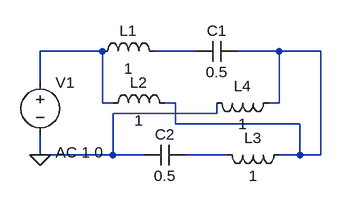
[diagram p0: schematic ej2.asc]
ej2.asc, the LTspice schematic file:
Version 4
SHEET 1 880 680
WIRE 96 64 0 64
WIRE 240 64 176 64
WIRE 368 64 304 64
WIRE 432 64 368 64
WIRE 0 112 0 64
WIRE 96 144 96 64
WIRE 112 144 96 144
WIRE 208 144 192 144
WIRE 368 144 368 64
WIRE 368 144 352 144
WIRE 272 160 272 144
WIRE 272 160 112 160
WIRE 208 176 208 144
WIRE 400 176 208 176
WIRE 0 224 0 192
WIRE 112 224 112 160
WIRE 112 224 0 224
WIRE 160 224 112 224
WIRE 288 224 224 224
WIRE 400 224 400 176
WIRE 400 224 368 224
WIRE 432 224 432 64
WIRE 432 224 400 224
FLAG 0 224 0
SYMBOL ind 80 80 R270
WINDOW 0 32 56 VTop 2
WINDOW 3 5 56 VBottom 2
SYMATTR InstName L1
SYMATTR Value 1
SYMBOL ind 96 160 R270
WINDOW 0 32 56 VTop 2
WINDOW 3 5 56 VBottom 2
SYMATTR InstName L2
SYMATTR Value 1
SYMBOL cap 240 80 R270
WINDOW 0 32 32 VTop 2
WINDOW 3 0 32 VBottom 2
SYMATTR InstName C1
SYMATTR Value 0.5
SYMBOL ind 384 208 R90
WINDOW 0 5 56 VBottom 2
WINDOW 3 32 56 VTop 2
SYMATTR InstName L3
SYMATTR Value 1
SYMBOL ind 368 128 R90
WINDOW 0 5 56 VBottom 2
WINDOW 3 32 56 VTop 2
SYMATTR InstName L4
SYMATTR Value 1
SYMBOL cap 224 208 R90
WINDOW 0 0 32 VBottom 2
WINDOW 3 32 32 VTop 2
SYMATTR InstName C2
SYMATTR Value 0.5
SYMBOL voltage 0 96 R0
WINDOW 123 24 124 Left 2
WINDOW 39 0 0 Left 0
SYMATTR InstName V1
SYMATTR Value ""
SYMATTR Value2 AC 1 0

The netlist it stands for:
* ej2.asc
L1 N001 N002 1
L2 N001 N003 1
C1 N002 N003 0.5
L3 N003 N004 1
L4 N003 0 1
C2 N004 0 0.5
V1 N001 0 AC 1 0
.backanno
.end